# Altium schematic sheet EPS_Temperature-Sensor.SchDoc: Temperature Sensor
size A4; CheckedBy: (not checked); Author: P. Kuligowski; SheetNumber: 14; SheetTotal: 51
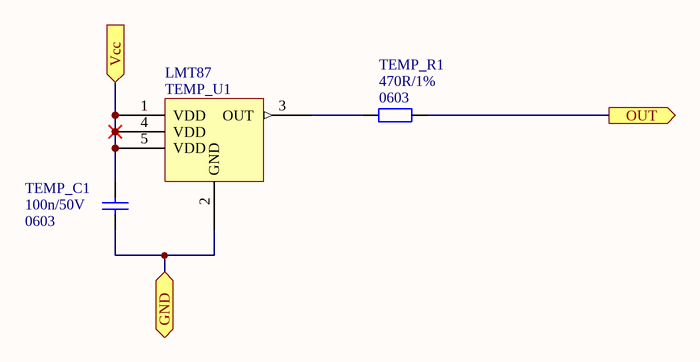
[diagram p0: EPS_Temperature-Sensor.SchDoc]

## Parts
TEMP_C1  Package: 0603  [SMD_Capacitor_0603]  (hidden comment: 100n/50V)
TEMP_R1  Package: 0603  [SMD_Resistor_0603]  (hidden comment: 470R/1%)
TEMP_U1  LMT87  [SC70-LT5_N]

## Ports
GND, OUT (out), Vcc (in)

## Nets
GND: TEMP_C1.2 TEMP_U1.2(GND) ; port GND
OUT: TEMP_R1.2 ; port OUT
Vcc: TEMP_C1.1 TEMP_U1.1(VDD) TEMP_U1.4(VDD) TEMP_U1.5(VDD) ; port Vcc
NetTEMP_R1_1: TEMP_R1.1 TEMP_U1.3(OUT)

## Notes on the sheet
- Title:
- Project:
- Author:
- Model:
- Document Number:
- Checked by:
- Rev:
- Date:
- Approved by:
- Sheet:
- of
- File name:

## Library data of the parts
TEMP_C1 = Cer_C0603T104K5RALTU: Ceramic Cap Kemet COTS 100n/50V X7R 0603; Manufacturer: Kemet; ManufacturerPartNumber: C0603T104K5RALTU; Value: 100n/50V
TEMP_R1 = CRCW06031K00FKxxxx: 1k/1% Vishay CRCW 0603 Resistor. 100mW, 100ppm, 75V.; Manufacturer: Vishay; ManufacturerPartNumber: CRCW06031K00FKxxxx; Value: 470R/1%
TEMP_U1 = LMT87: Analog Temperature Sensors with Class-AB Output